# Altium schematic sheet ITBA Template A4.SchDoc
size 292 x 193 mm; SheetNumber: 11; SheetTotal: 11
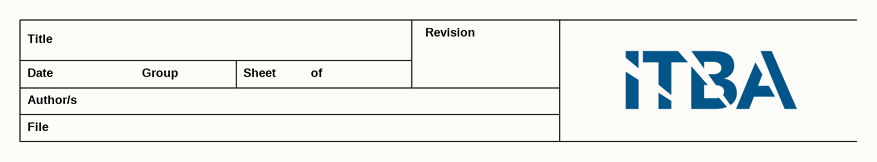
[diagram p0: ITBA Template A4.SchDoc]

## Notes on the sheet
- Title
- Revision
- Date
- Author/s
- Group
- Sheet
- of
- File